# Altium schematic sheet sd_card_module.SchDoc
size A3
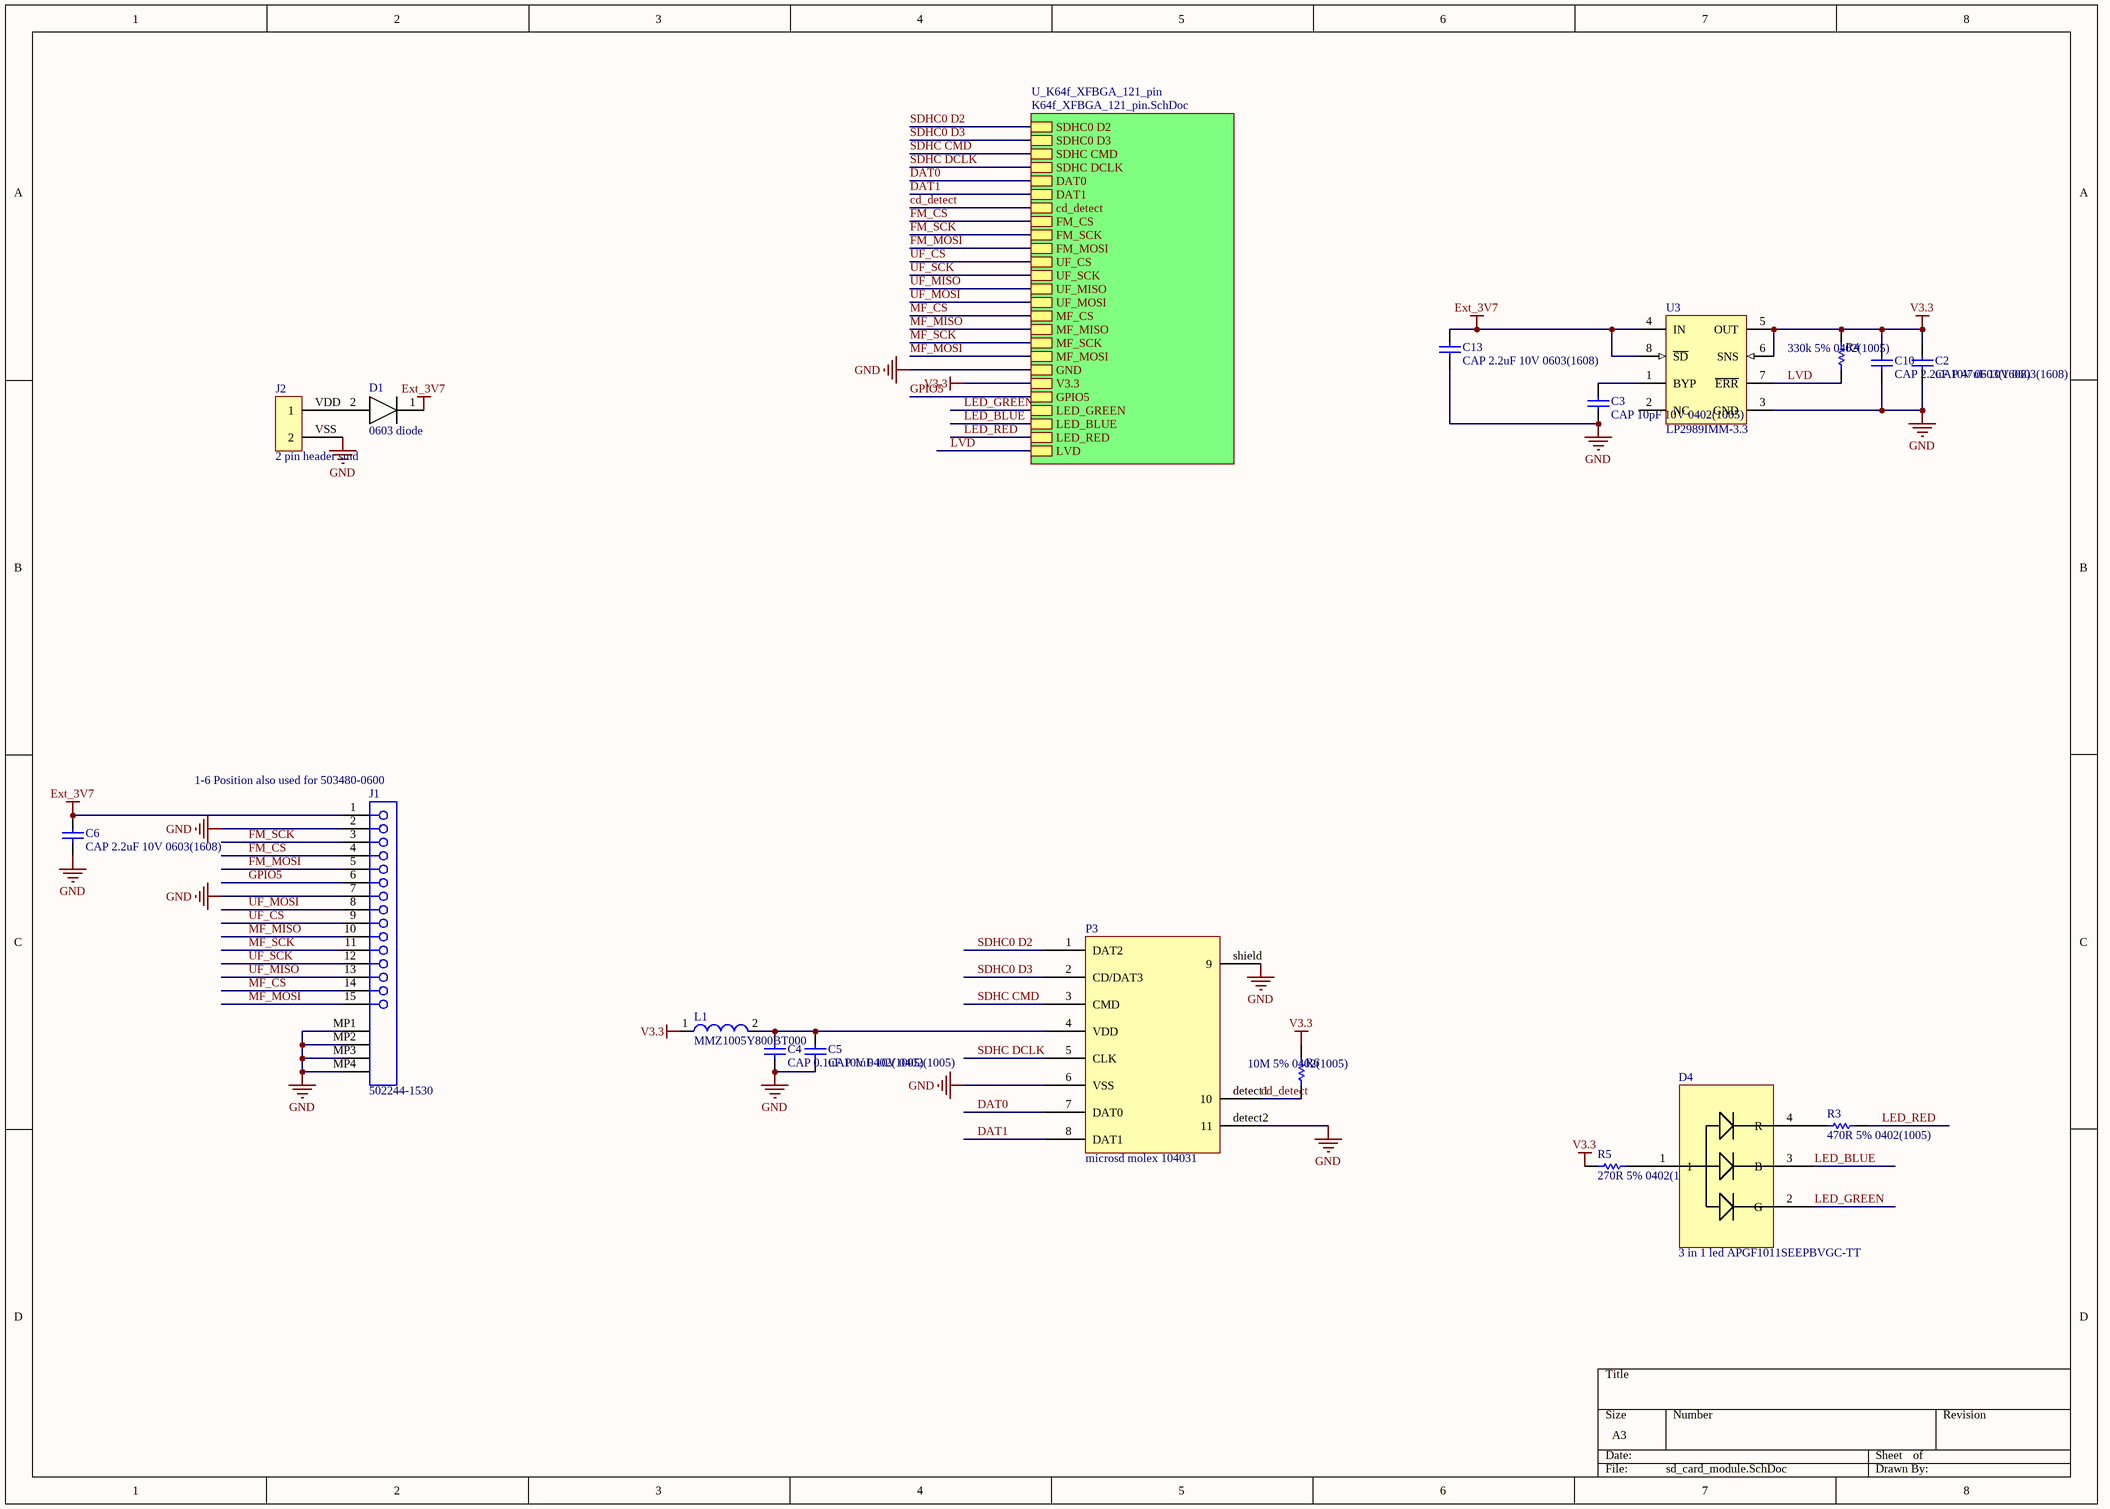
[diagram p0: sd_card_module.SchDoc]

## Parts
C2  CAP 47uF 10V 0603(1608)  [CAPC0603(1608)100_M]
C3  CAP 10pF 10V 0402(1005)  [CAPC0402(1005)60_M]
C4  CAP 0.1uF 10V 0402(1005)  [CAPC0402(1005)60_M]
C5  CAP 1uF 10V 0402(1005)  [CAPC0402(1005)60_M]
C6  CAP 2.2uF 10V 0603(1608)  [CAPC0603(1608)100_M]
C10  CAP 2.2uF 10V 0603(1608)  [CAPC0603(1608)100_M]
C13  CAP 2.2uF 10V 0603(1608)  [CAPC0603(1608)100_M]
D1  0603 diode  [DIOC0603X03N]
D4  3 in 1 led APGF1011SEEPBVGC-TT  [APGF1011SEEPBVGC-TT]
J1  502244-1530  [MOLX-502244-1530 long_pins]
J2  2 pin header smd  [2 pin header picolock]
L1  MMZ1005Y800BT000  [SMD-0402]
P3  microsd molex 104031  [MICROSD 104031 molex]
R3  470R 5% 0402(1005)  [RESC0402(1005)_L]
R4  330k 5% 0402(1005)  [RESC0402(1005)_L]
R5  270R 5% 0402(1005)  [RESC0402(1005)_L]
R6  10M 5% 0402(1005)  [RESC0402(1005)_L]
U3  LP2989IMM-3.3  [MUA08A_L]

## Sub-sheets
U_K64f_XFBGA_121_pin = K64f_XFBGA_121_pin.SchDoc: SDHC0 D2, SDHC0 D3, SDHC CMD, SDHC DCLK, DAT0, DAT1, cd_detect, FM_CS, FM_SCK, FM_MOSI, UF_CS, UF_SCK, UF_MISO, UF_MOSI, MF_CS, MF_MISO, MF_SCK, MF_MOSI, GND, V3.3, GPIO5, LED_GREEN, LED_BLUE, LED_RED, LVD

## Nets
Ext_3V7: C6.2 C13.2 D1.1 J1.1 U3.4(IN) U3.8(~{SD})
GND: C2.1 C3.1 C4.1 C5.1 C6.1 C10.1 C13.1 J1.2 J1.7 J1.MP1 J1.MP2 J1.MP3 J1.MP4 J2.VSS(2) P3.6(VSS) P3.detect2(11) P3.shield(9) U3.3(GND) ; sheet U_K64f_XFBGA_121_pin/GND
V3.3: C2.2 C10.2 L1.1 R4.1 R5.1 R6.1 U3.5(OUT) U3.6(SNS) ; sheet U_K64f_XFBGA_121_pin/V3.3
cd_detect: P3.detect1(10) R6.2 ; sheet U_K64f_XFBGA_121_pin/cd_detect
DAT0: P3.7(DAT0) ; sheet U_K64f_XFBGA_121_pin/DAT0
DAT1: P3.8(DAT1) ; sheet U_K64f_XFBGA_121_pin/DAT1
FM_CS: J1.4 ; sheet U_K64f_XFBGA_121_pin/FM_CS
FM_MOSI: J1.5 ; sheet U_K64f_XFBGA_121_pin/FM_MOSI
FM_SCK: J1.3 ; sheet U_K64f_XFBGA_121_pin/FM_SCK
GPIO5: J1.6 ; sheet U_K64f_XFBGA_121_pin/GPIO5
LED_BLUE: D4.3(B) ; sheet U_K64f_XFBGA_121_pin/LED_BLUE
LED_GREEN: D4.2(G) ; sheet U_K64f_XFBGA_121_pin/LED_GREEN
LED_RED: R3.2 ; sheet U_K64f_XFBGA_121_pin/LED_RED
LVD: R4.2 U3.7(~{ERR}) ; sheet U_K64f_XFBGA_121_pin/LVD
MF_CS: J1.14 ; sheet U_K64f_XFBGA_121_pin/MF_CS
MF_MISO: J1.10 ; sheet U_K64f_XFBGA_121_pin/MF_MISO
MF_MOSI: J1.15 ; sheet U_K64f_XFBGA_121_pin/MF_MOSI
MF_SCK: J1.11 ; sheet U_K64f_XFBGA_121_pin/MF_SCK
SDHC0 D2: P3.1(DAT2) ; sheet U_K64f_XFBGA_121_pin/SDHC0 D2
SDHC0 D3: P3.2(CD/DAT3) ; sheet U_K64f_XFBGA_121_pin/SDHC0 D3
SDHC CMD: P3.3(CMD) ; sheet U_K64f_XFBGA_121_pin/SDHC CMD
SDHC DCLK: P3.5(CLK) ; sheet U_K64f_XFBGA_121_pin/SDHC DCLK
UF_CS: J1.9 ; sheet U_K64f_XFBGA_121_pin/UF_CS
UF_MISO: J1.13 ; sheet U_K64f_XFBGA_121_pin/UF_MISO
UF_MOSI: J1.8 ; sheet U_K64f_XFBGA_121_pin/UF_MOSI
UF_SCK: J1.12 ; sheet U_K64f_XFBGA_121_pin/UF_SCK
NetC3_2: C3.2 U3.1(BYP)
NetC4_2: C4.2 C5.2 L1.2 P3.4(VDD)
NetD1_2: D1.2 J2.VDD(1)
NetD4_1: D4.1 R5.2
NetD4_4: D4.4(R) R3.1

Not connected (* = marked no-connect by the designer): U3 2(NC)

## Notes on the sheet
- (near J1) 1-6 Position also used for 503480-0600

## Library data of the parts
C2 = CMP-1035-00147-1: CAP 47uF 10V ±0.1pF 0603 (1608 Metric) Thickness 1mm SMD; Case-Metric: 1608; Case-EIA: 0603; Tolerance: Â±0.1pF; Max Thickness: 1 mm; Rated Voltage: 10 V; Value: 47uF; Technology: SMT
C3 = CMP-1034-00013-1: CAP 10pF 10V ±0.1pF 0402 (1005 Metric) Thickness 0.6mm SMD; Case-Metric: 1005; Tolerance: Â±0.1pF; Case-EIA: 0402; Value: 10pF; Max Thickness: 0.6 mm; Rated Voltage: 10 V; Technology: SMT
C4 = CMP-1034-00013-1: CAP 0.5pF 10V ±0.1uF 0402 (1005 Metric) Thickness 0.6mm SMD; Case-Metric: 1005; Tolerance: Â±0.1pF; Case-EIA: 0402; Value: 0.1uF; Max Thickness: 0.6 mm; Rated Voltage: 10 V; Technology: SMT
C5 = CMP-1034-00013-1: CAP 1uF 10V ±1uF 0402 (1005 Metric) Thickness 0.6mm SMD; Case-Metric: 1005; Tolerance: Â±0.1pF; Case-EIA: 0402; Value: 1uF; Max Thickness: 0.6 mm; Rated Voltage: 10 V; Technology: SMT
C6 C10 C13 = CMP-1035-00147-1: CAP 2.2uF 10V ±0.1pF 0603 (1608 Metric) Thickness 1mm SMD; Case-Metric: 1608; Case-EIA: 0603; Tolerance: Â±0.1pF; Max Thickness: 1 mm; Rated Voltage: 10 V; Value: 2.2uF; Technology: SMT
J1 = MOLX-502244-1530
L1 = CMP-0220-00098-1: EMI Filter Beads, Chips & Arrays 0402 80ohms 250mA HiSpd Signal Line; Impedance: 20 Ohm; ComponentLink2URL: http://www.we-online.de/katalog/media/pdf/74279273.pdf; DatasheetVersion: ver 6, Jul-2009; PackageVersion: 2009; PackageDescription: Chip Inductor, 2-Leads, Body 1.0 x 0.5 mm; ComponentLink1URL: http://www.we-online.com; ComponentLink2Description: Datasheet; PackageReference: SMD-0402; ComponentLink1Description: Manufacturer Link
R3 = CMP-1011-00090-1: 470R 5% 0402 (1005 Metric)  SMD; Value: 470.00 Ohm; Case-Metric: 1005; Power: 0.063 W; Case-EIA: 0402; Tolerance: 5 %; Technology: SMT
R4 = CMP-1011-00090-1: 330k 0.063W 5% 0402 (1005 Metric)  SMD; Case-Metric: 1005; Case-EIA: 0402; Tolerance: 5 %; Value: 330k; Power: 0.063 W; Technology: SMT
R5 = CMP-1011-00090-1: 270R W 5% 0402 (1005 Metric)  SMD; Value: 270; Case-Metric: 1005; Power: 0.063 W; Case-EIA: 0402; Tolerance: 5 %; Technology: SMT
R6 = CMP-1011-00090-1: 10M 0.063W 5% 0402 (1005 Metric)  SMD; Case-Metric: 1005; Case-EIA: 0402; Tolerance: 5 %; Value: 10M; Power: 0.063 W; Technology: SMT
U3 = CMP-0062-02283-2: Micropower/Low Noise, 500 mA Ultra Low-Dropout Regulator, 8-pin Mini SOIC; Manufacturer: National Semiconductor; PackageTopMarking: ZXTT*LA2B; PowerWise: N; CompType: LDO IC; RevisionNote: Component URLs added; ComponentLink2URL: http://www.national.com/pf/LP/LP2989.html; DatasheetVersion: Feb-2005; PackageVersion: revF, Apr-2008; PackageReference: MUA08A; ComponentLink3Description: MUA08A Package Page; PackageDescription: MINI SOIC, .118 x .118 x .034in, 8 Lead, .0256in Pitch; RoHS: N; ComponentLink2Description: LP2989 Web Page; Code_JEDEC: MO-187-AA; ComponentLink3URL: http://www.national.com/packaging/folders/mua08a.html; PinCount: 8; ComponentLink1Description: LP2989 Datasheet; ComponentLink1URL: http://www.national.com/ds/LP/LP2989.pdf